# EAGLE schematic BRD_Board_G1_v53 (EAGLE 9.7.0)
COMPANY: ADAFRUIT INDUSTRIES; DRAWN: KTOWN; REV: B
Assembly variants: INDOOR, OUTDOOR
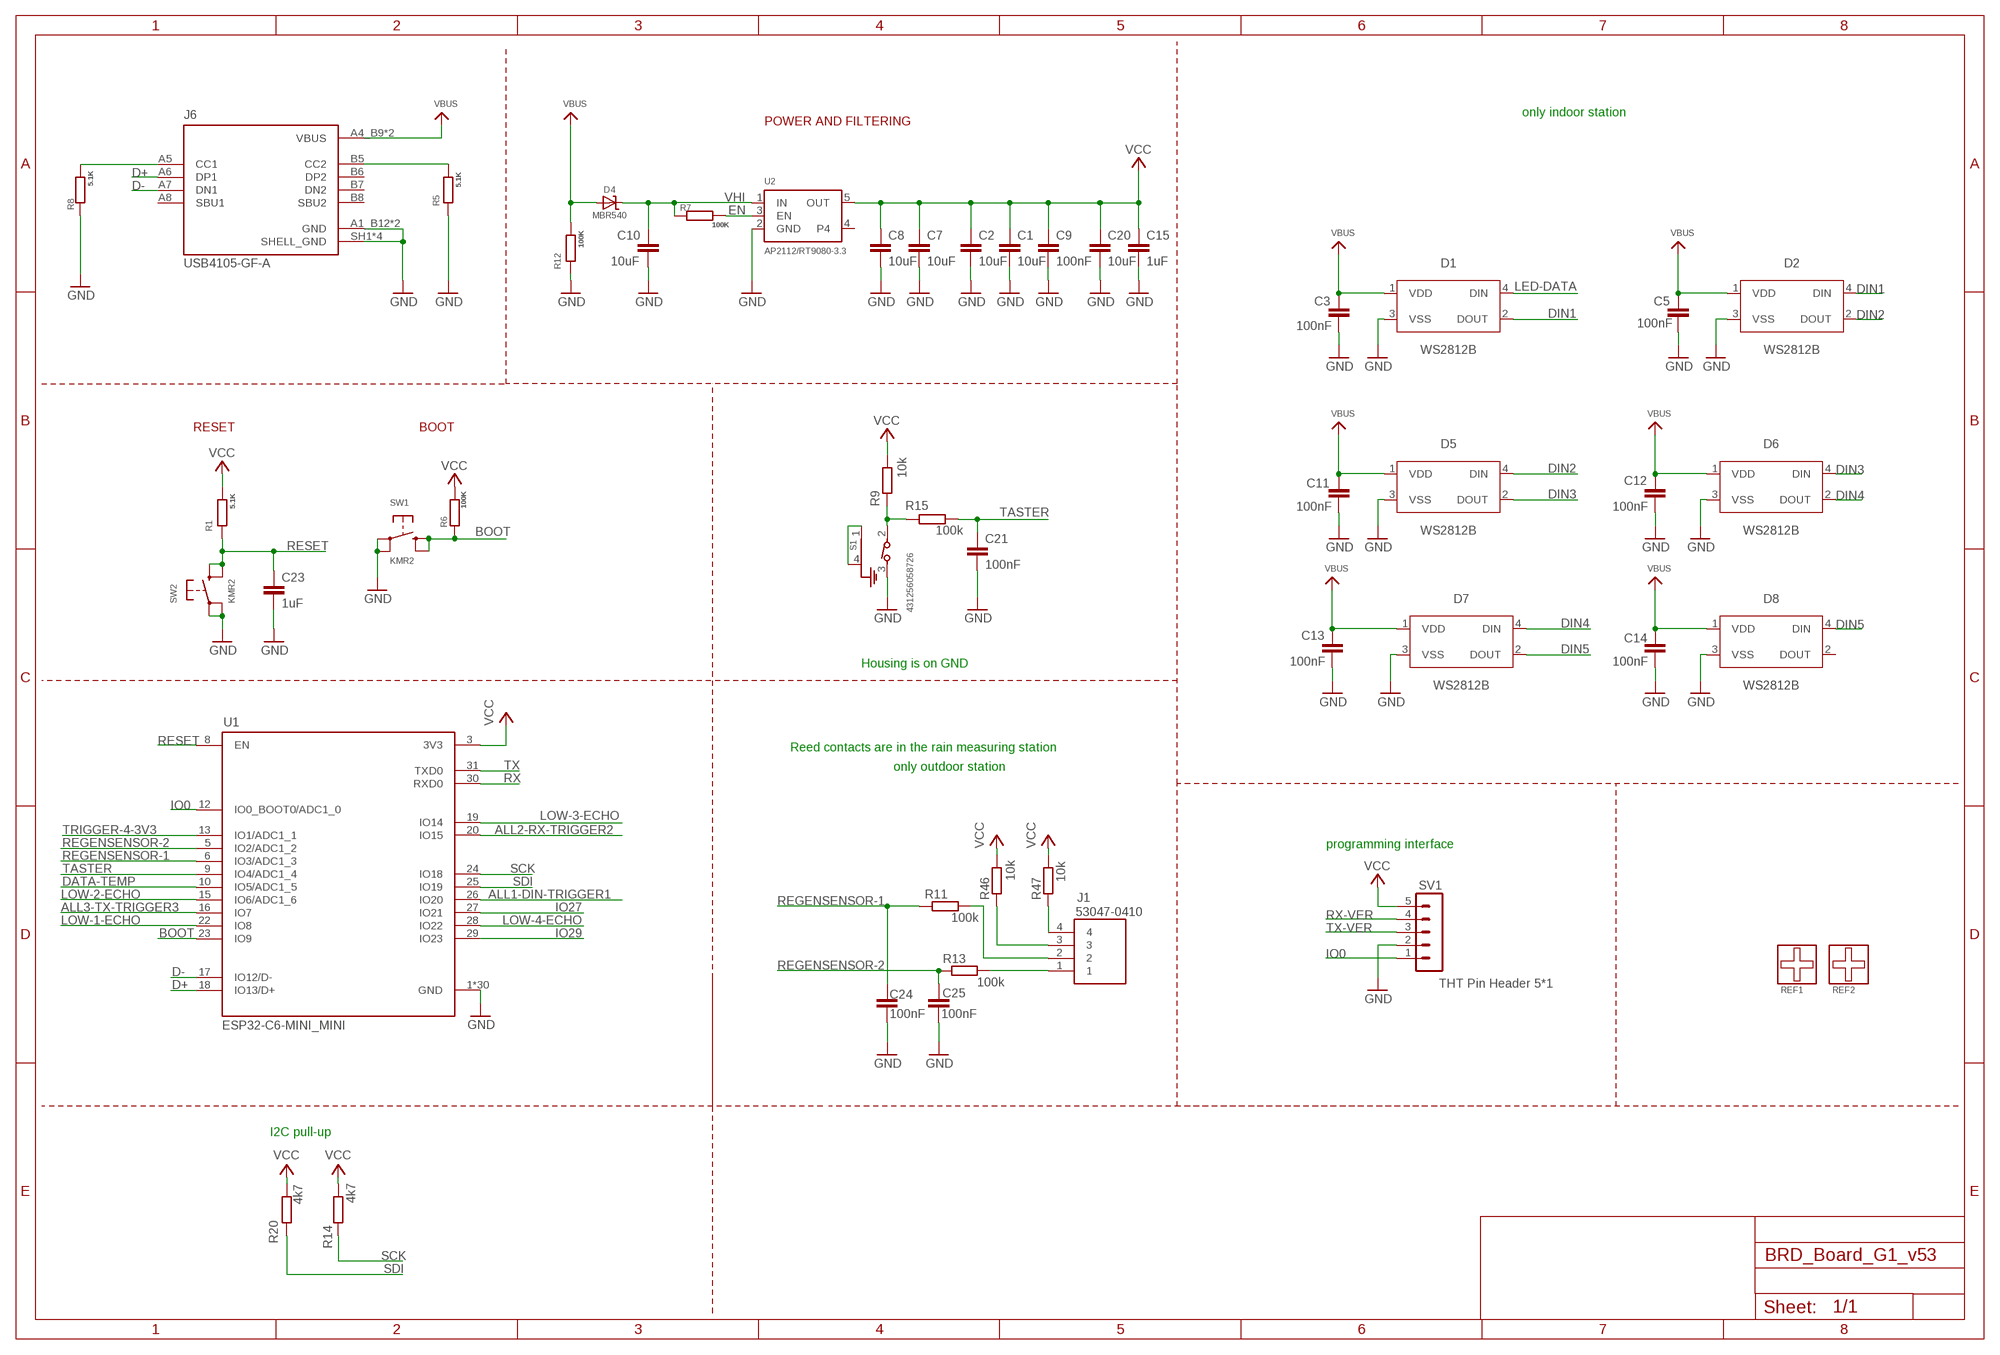
[diagram p0: schematic, sheet 1, part 1 of 2]
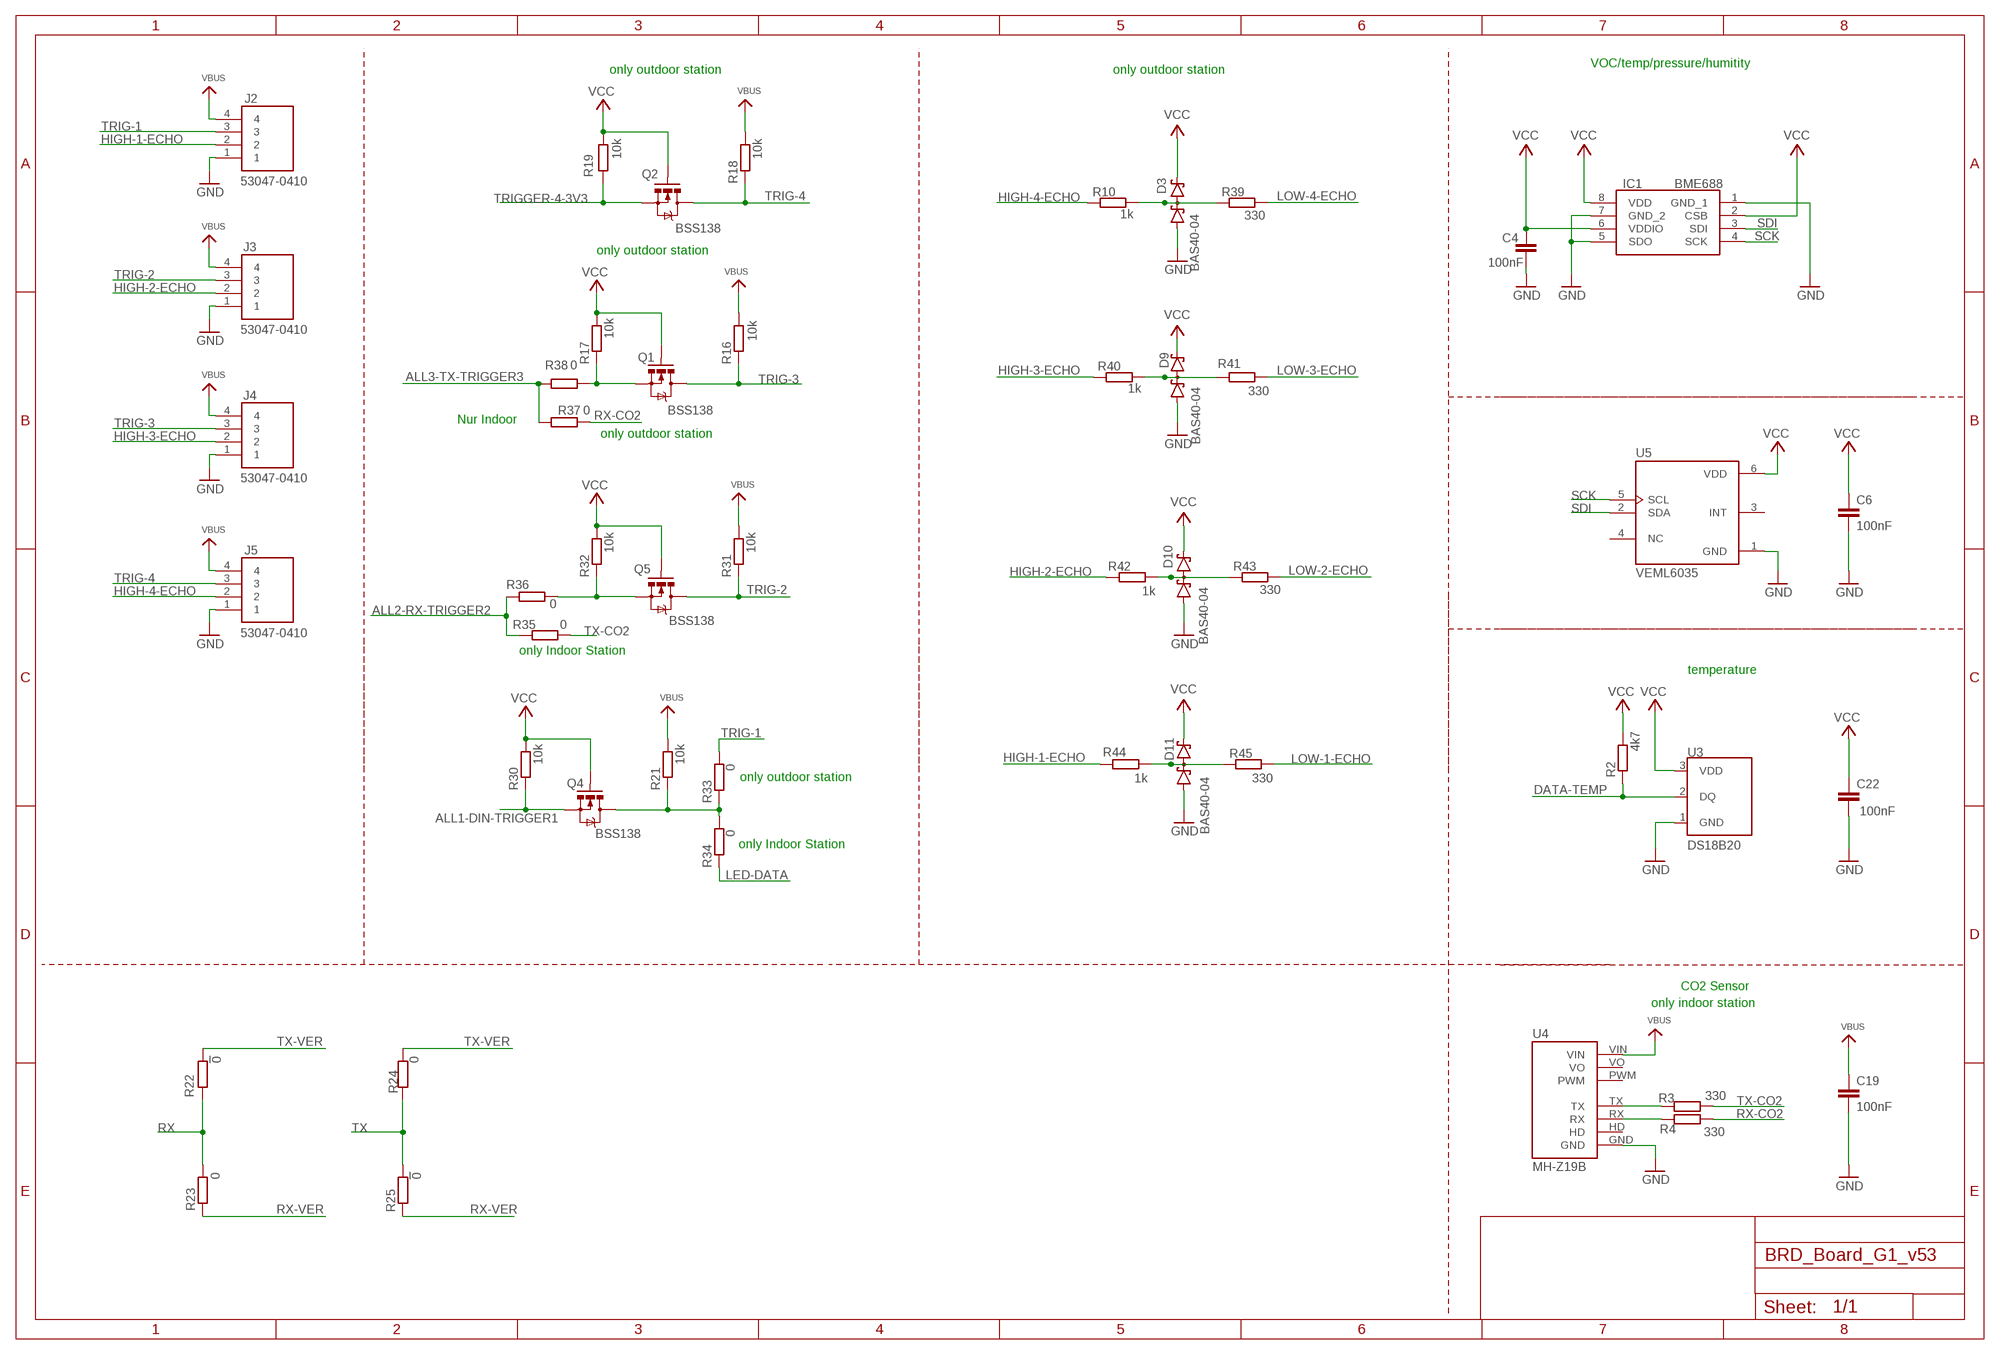
[diagram p1: schematic, sheet 1, part 2 of 2]

## Parts
C1  10uF  C-EUC0805K  [C0805K]
C2  10uF  C-EUC0805K  [C0805K]
C3  100nF  C-EUC0603K  [C0603K]  (not fitted in variant OUTDOOR)
C4  100nF  C-EUC0603K  [C0603K]
C5  100nF  C-EUC0603K  [C0603K]  (not fitted in variant OUTDOOR)
C6  100nF  C-EUC0603K  [C0603K]
C7  10uF  C-EUC0805K  [C0805K]
C8  10uF  C-EUC0805K  [C0805K]
C9  100nF  C-EUC0603K  [C0603K]
C10  10uF  C-EUC0805K  [C0805K]
C11  100nF  C-EUC0603K  [C0603K]  (not fitted in variant OUTDOOR)
C12  100nF  C-EUC0603K  [C0603K]  (not fitted in variant OUTDOOR)
C13  100nF  C-EUC0603K  [C0603K]  (not fitted in variant OUTDOOR)
C14  100nF  C-EUC0603K  [C0603K]  (not fitted in variant OUTDOOR)
C15  1uF  C-EUC0603K  [C0603K]
C19  100nF  C-EUC0603K  [C0603K]  (not fitted in variant OUTDOOR)
C20  10uF  C-EUC0805K  [C0805K]
C21  100nF  C-EUC0603K  [C0603K]
C22  100nF  C-EUC0603K  [C0603K]
C23  1uF  C-EUC0805K  [C0805K]
C24  100nF  C-EUC0603K  [C0603K]  (not fitted in variant INDOOR)
C25  100nF  C-EUC0603K  [C0603K]  (not fitted in variant INDOOR)
D1  WS2812B  [WS2812B]  (not fitted in variant OUTDOOR)
D2  WS2812B  [WS2812B]  (not fitted in variant OUTDOOR)
D3  BAS40-04  [SOT23]  (not fitted in variant INDOOR)
D4  MBR540  DIODE-SCHOTTKYSOD-123  [SOD-123]
D5  WS2812B  [WS2812B]  (not fitted in variant OUTDOOR)
D6  WS2812B  [WS2812B]  (not fitted in variant OUTDOOR)
D7  WS2812B  [WS2812B]  (not fitted in variant OUTDOOR)
D8  WS2812B  [WS2812B]  (not fitted in variant OUTDOOR)
D9  BAS40-04  [SOT23]  (not fitted in variant INDOOR)
D10  BAS40-04  [SOT23]  (not fitted in variant INDOOR)
D11  BAS40-04  [SOT23]  (not fitted in variant INDOOR)
IC1  BME688  [BME688]
J1  53047-0410  [530470410]  (not fitted in variant INDOOR)  (not fitted in variant OUTDOOR)
J2  53047-0410  [530470410]  (not fitted in variant INDOOR)  (not fitted in variant OUTDOOR)
J3  53047-0410  [530470410]  (not fitted in variant INDOOR)  (not fitted in variant OUTDOOR)
J4  53047-0410  [530470410]  (not fitted in variant INDOOR)  (not fitted in variant OUTDOOR)
J5  53047-0410  [530470410]  (not fitted in variant INDOOR)  (not fitted in variant OUTDOOR)
J6  USB4105-GF-A  [GCT_USB4105-GF-A]
Q1  BSS138  MOSFET-NCHANNELBSS138  [SOT23]  (not fitted in variant INDOOR)
Q2  BSS138  MOSFET-NCHANNELBSS138  [SOT23]  (not fitted in variant INDOOR)
Q4  BSS138  MOSFET-NCHANNELBSS138  [SOT23]
Q5  BSS138  MOSFET-NCHANNELBSS138  [SOT23]  (not fitted in variant INDOOR)
R1  5.1K  R-EU_R0805  [R0805]
R2  4k7  R-EU_R0805  [R0805]
R3  330  R-EU_R0805  [R0805]  (not fitted in variant OUTDOOR)
R4  330  R-EU_R0805  [R0805]  (not fitted in variant OUTDOOR)
R5  5.1K  R-EU_R0805  [R0805]
R6  100K  R-EU_R0805  [R0805]
R7  100K  R-EU_R0805  [R0805]
R8  5.1K  R-EU_R0805  [R0805]
R9  10k  R-EU_R0805  [R0805]
R10  1k  R-EU_R0805  [R0805]  (not fitted in variant INDOOR)
R11  100k  R-EU_R0805  [R0805]  (not fitted in variant INDOOR)
R12  100K  R-EU_R0805  [R0805]
R13  100k  R-EU_R0805  [R0805]  (not fitted in variant INDOOR)
R14  4k7  R-EU_R0805  [R0805]
R15  100k  R-EU_R0805  [R0805]
R16  10k  R-EU_R0805  [R0805]  (not fitted in variant INDOOR)
R17  10k  R-EU_R0805  [R0805]  (not fitted in variant INDOOR)
R18  10k  R-EU_R0805  [R0805]  (not fitted in variant INDOOR)
R19  10k  R-EU_R0805  [R0805]  (not fitted in variant INDOOR)
R20  4k7  R-EU_R0805  [R0805]
R21  10k  R-EU_R0805  [R0805]
R22  !0  R-EU_R0805  [R0805]  (not fitted in variant INDOOR)  (not fitted in variant OUTDOOR)
R23  0  R-EU_R0805  [R0805]
R24  0  R-EU_R0805  [R0805]
R25  !0  R-EU_R0805  [R0805]  (not fitted in variant INDOOR)  (not fitted in variant OUTDOOR)
R30  10k  R-EU_R0805  [R0805]
R31  10k  R-EU_R0805  [R0805]  (not fitted in variant INDOOR)
R32  10k  R-EU_R0805  [R0805]  (not fitted in variant INDOOR)
R33  0  R-EU_R0805  [R0805]  (not fitted in variant INDOOR)
R34  0  R-EU_R0805  [R0805]  (not fitted in variant OUTDOOR)
R35  0  R-EU_R0805  [R0805]  (not fitted in variant OUTDOOR)
R36  0  R-EU_R0805  [R0805]  (not fitted in variant INDOOR)
R37  0  R-EU_R0805  [R0805]  (not fitted in variant OUTDOOR)
R38  0  R-EU_R0805  [R0805]  (not fitted in variant INDOOR)
R39  330  R-EU_R0805  [R0805]  (not fitted in variant INDOOR)
R40  1k  R-EU_R0805  [R0805]  (not fitted in variant INDOOR)
R41  330  R-EU_R0805  [R0805]  (not fitted in variant INDOOR)
R42  1k  R-EU_R0805  [R0805]  (not fitted in variant INDOOR)
R43  330  R-EU_R0805  [R0805]  (not fitted in variant INDOOR)
R44  1k  R-EU_R0805  [R0805]  (not fitted in variant INDOOR)
R45  330  R-EU_R0805  [R0805]  (not fitted in variant INDOOR)
R46  10k  R-EU_R0805  [R0805]  (not fitted in variant INDOOR)
R47  10k  R-EU_R0805  [R0805]  (not fitted in variant INDOOR)
REF1  FIDUCIALFIDU_1_3_MM  [FIDU_1_3MM]  (not fitted in variant INDOOR)  (not fitted in variant OUTDOOR)
REF2  FIDUCIALFIDU_1_3_MM  [FIDU_1_3MM]  (not fitted in variant INDOOR)  (not fitted in variant OUTDOOR)
S1  431256058726  [4312560587X6]  (not fitted in variant INDOOR)  (not fitted in variant OUTDOOR)
SV1  THT Pin Header 5*1  MAR05-1  [MAR05-1]  (not fitted in variant INDOOR)  (not fitted in variant OUTDOOR)
SW1  KMR2  SWITCH_TACT_SMT_RKB2  [BTN_RKB2_4.6X2.8]
SW2  KMR2  SWITCH_TACT_SMT_RKB2  [BTN_RKB2_4.6X2.8]
U1  ESP32-C6-MINI_MINI  [ESP32-PICO-MINI]
U2  AP2112/RT9080-3.3  VREG_SOT23-5  [SOT23-5]
U3  DS18B20  [TO-92-AMMO]  (not fitted in variant INDOOR)  (not fitted in variant OUTDOOR)
U4  MH-Z19B  [MH-Z19B]  (not fitted in variant OUTDOOR)  (not fitted in variant INDOOR)
U5  VEML6035  [XDCR_VEML6035]

## Nets
ALL1-DIN-TRIGGER1: Q4.2(S) R30.1 U1.26(IO20)
ALL2-RX-TRIGGER2: R35.1 R36.1 U1.20(IO15)
ALL3-TX-TRIGGER3: R37.1 R38.1 U1.16(IO7)
BOOT: R6.1 SW1.B'(S1) SW1.B(S) U1.23(IO9)
D+: J6.A6(DP1) U1.18(IO13/D+)
D-: J6.A7(DN1) U1.17(IO12/D-)
DATA-TEMP: R2.1 U1.10(IO5/ADC1_5) U3.2(DQ)
DIN1: D1.2(DOUT) D2.4(DIN)
DIN2: D2.2(DOUT) D5.4(DIN)
DIN3: D5.2(DOUT) D6.4(DIN)
DIN4: D6.2(DOUT) D7.4(DIN)
DIN5: D7.2(DOUT) D8.4(DIN)
EN: R7.1 U2.3(EN)
GND: C1.2 C2.2 C3.2 C4.1 C5.2 C6.2 C7.2 C8.2 C9.2 C10.2 C11.2 C12.2 C13.2 C14.2 C15.2 C19.2 C20.2 C21.2 C22.1 C23.2 C24.2 C25.2 D1.3(VSS) D2.3(VSS) D3.1(A1) D5.3(VSS) D6.3(VSS) D7.3(VSS) D8.3(VSS) D9.1(A1) D10.1(A1) D11.1(A1) IC1.1(GND_1) IC1.5(SDO) IC1.7(GND_2) J2.1 J3.1 J4.1 J5.1 J6.A1_B12(GND) J6.B1_A12(GND) J6.SH1(SHELL_GND) J6.SH2(SHELL_GND) J6.SH3(SHELL_GND) J6.SH4(SHELL_GND) R5.1 R8.1 R12.1 S1.3 SV1.2 SW1.A'(P1) SW1.A(P) SW2.A'(P1) SW2.A(P) U1.1(GND) U1.2(GND) U1.11(GND) U1.14(GND) U1.36(GND) U1.37(GND) U1.38(GND) U1.39(GND) U1.40(GND) U1.41(GND) U1.42(GND) U1.43(GND) U1.44(GND) U1.45(GND) U1.46(GND) U1.47(GND) U1.48(GND) U1.49(GND) U1.50(GND) U1.51(GND) U1.52(GND) U1.53(GND) U1.54(GND) U1.55(GND) U1.56(GND) U1.57(GND) U1.58(GND) U1.59(GND) U1.60(GND) U1.61(GND) U2.2(GND) U3.1(GND) U4.GND U5.1(GND)
HIGH-1-ECHO: J2.2 R44.2
HIGH-2-ECHO: J3.2 R42.2
HIGH-3-ECHO: J4.2 R40.2
HIGH-4-ECHO: J5.2 R10.2
IO0: SV1.1 U1.12(IO0_BOOT0/ADC1_0)
IO27: U1.27(IO21)
IO29: U1.29(IO23)
LED-DATA: D1.4(DIN) R34.1
LOW-1-ECHO: R45.1 U1.22(IO8)
LOW-2-ECHO: R43.1 U1.15(IO6/ADC1_6)
LOW-3-ECHO: R41.1 U1.19(IO14)
LOW-4-ECHO: R39.1 U1.28(IO22)
N$1: R4.2 U4.RX
N$2: R9.1 R15.2 S1.2
N$3: R3.2 U4.TX
N$4: S1.1(GND1) S1.4(GND)
N$5: D3.3(C1A2) R10.1 R39.2
N$6: D9.3(C1A2) R40.1 R41.2
N$7: Q1.2(S) R17.1 R38.2
N$8: J6.A5(CC1) R8.2
N$9: J6.B5(CC2) R5.2
N$10: D10.3(C1A2) R42.1 R43.2
N$11: D11.3(C1A2) R44.1 R45.2
N$12: J1.3 R46.1
N$13: J1.4 R47.1
N$15: Q5.2(S) R32.1 R36.2
N$16: Q4.3(D) R21.1 R33.1 R34.2
N$17: J1.2 R11.1
N$19: J1.1 R13.1
REGENSENSOR-1: C24.1 R11.2 U1.6(IO3/ADC1_3)
REGENSENSOR-2: C25.1 R13.2 U1.5(IO2/ADC1_2)
RESET: C23.1 R1.1 SW2.B'(S1) SW2.B(S) U1.8(EN)
RX: R22.2 R23.1 U1.30(RXD0)
RX-CO2: R4.1 R37.2
RX-VER: R23.2 R25.2 SV1.4
SCK: IC1.4(SCK) R14.1 U1.24(IO18) U5.5(SCL)
SDI: IC1.3(SDI) R20.1 U1.25(IO19) U5.2(SDA)
TASTER: C21.1 R15.1 U1.9(IO4/ADC1_4)
TRIG-1: J2.3 R33.2
TRIG-2: J3.3 Q5.3(D) R31.1
TRIG-3: J4.3 Q1.3(D) R16.1
TRIG-4: J5.3 Q2.3(D) R18.1
TRIGGER-4-3V3: Q2.2(S) R19.1 U1.13(IO1/ADC1_1)
TX: R24.2 R25.1 U1.31(TXD0)
TX-CO2: R3.1 R35.2
TX-VER: R22.1 R24.1 SV1.3
VBUS: C3.1 C5.1 C11.1 C12.1 C13.1 C14.1 C19.1 D1.1(VDD) D2.1(VDD) D4.A D5.1(VDD) D6.1(VDD) D7.1(VDD) D8.1(VDD) J2.4 J3.4 J4.4 J5.4 J6.A4_B9(VBUS) J6.B4_A9(VBUS) R12.2 R16.2 R18.2 R21.2 R31.2 U4.VIN
VCC: C1.1 C2.1 C4.2 C6.1 C7.1 C8.1 C9.1 C15.1 C20.1 C22.2 D3.2(C2) D9.2(C2) D10.2(C2) D11.2(C2) IC1.2(CSB) IC1.6(VDDIO) IC1.8(VDD) Q1.1(G) Q2.1(G) Q4.1(G) Q5.1(G) R1.2 R2.2 R6.2 R9.2 R14.2 R17.2 R19.2 R20.2 R30.2 R32.2 R46.2 R47.2 SV1.5 U1.3(3V3) U2.5(OUT) U3.3(VDD) U5.6(VDD)
VHI: C10.1 D4.C R7.2 U2.1(IN)
Unconnected: D8.2(DOUT) J6.A8(SBU1) J6.B6(DP2) J6.B7(DN2) J6.B8(SBU2) REF1.P$1 REF2.P$1 U2.4 U4.HD U4.PWM U4.VO U5.3(INT) U5.4(NC)

## Notes on the sheet
- VOC/temp/pressure/humitity
- only outdoor station | only outdoor station
- only indoor station
- POWER AND FILTERING
- only outdoor station
- RESET | BOOT | Nur Indoor
- only outdoor station
- only Indoor Station
- Housing is on GND
- temperature
- Reed contacts are in the rain measuring station
- only outdoor station
- only outdoor station
- programming interface | only Indoor Station
- CO2 Sensor
- only indoor station
- I2C pull-up

## Library data of the parts
C1-C15 C19-C25 = rcl:C-EU: CAPACITOR, European symbol; SPICEPREFIX: C
D1 D2 D5-D8 = LED:WS2812B: Intelligent control LED integrated light source Datasheet <https://cdn-shop.adafruit.com/datasheets/WS2812B.pdf>; CATEGORY: LED; COLOR: RGB; DATASHEET: https://cdn-shop.adafruit.com/datasheets/WS2812B.pdf; DESCRIPTION: LED integrated light source; MANUFACTURER: Worldsemi; MPN: WS2812B; OPERATING_TEMPERATURE: -55°C ~ 150°C; PACKAGE_SIZE: 5050; PACKAGE_TYPE: SMD; PART_STATUS: ACTIVE; ROHS: COMPLIANT; SERIES: WS2812B; SUBCATEGORY: Chip LED Addressable; TYPE: Square with Flat Top
D3 D9-D11 = diode:BAS40-04: Silicon Schottky Diodes General-purpose diode for high-speed switching
D4 = microbuilder:DIODE-SCHOTTKY
IC1 = BME688:BME688: Gas sensor measuring relative humidity, barometric pressure, ambient temperature and gas (VOC) Source: Datasheet <https://www.bosch-sensortec.com/media/boschsensortec/downloads/datasheets/bst-bme688-ds000.pdf>; DESCRIPTION: Gas sensor measuring relative humidity, barometric pressure, ambient temperature and gas (VOC); HEIGHT: 1mm; MANUFACTURER_NAME: BOSCH; MANUFACTURER_PART_NUMBER: BME688; MOUSER_PART_NUMBER: 262-BME688; MOUSER_PRICE-STOCK: https://www.mouser.co.uk/ProductDetail/Bosch-Sensortec/BME688?qs=IS%252B4QmGtzzqQoVDscqwx3A%3D%3D
J1-J5 = 53047-0410:53047-0410: Headers & Wire Housings VERTICAL HDR 4P Source: Datasheet <https://www.molex.com/pdm_docs/sd/530470410_sd.pdf>; DESCRIPTION: Headers & Wire Housings VERTICAL HDR 4P; HEIGHT: 4.4mm; MANUFACTURER_NAME: Molex; MANUFACTURER_PART_NUMBER: 53047-0410; MOUSER_PART_NUMBER: 538-53047-0410; MOUSER_PRICE-STOCK: https://www.mouser.co.uk/ProductDetail/Molex/53047-0410?qs=DcEdecHHM4i8IPBxVAuJtg%3D%3D
J6 = USB4105-GF-A:USB4105-GF-A: Check availability <https://pricing.snapeda.com/parts/USB4105-GF-A/GCT/view-part?ref=eda>; AVAILABILITY: In Stock; CHECK_PRICES: https://www.snapeda.com/parts/USB4105-GF-A/Global+Connector+Technology/view-part/?ref=eda; DESCRIPTION: USB-C (USB TYPE-C) USB 2.0 Receptacle Connector 24 (16+8 Dummy) Position Surface Mount, Right Angle; Through Hole; MF: GCT; MP: USB4105-GF-A; PACKAGE: None; PRICE: None; SNAPEDA_LINK: https://www.snapeda.com/parts/USB4105-GF-A/Global+Connector+Technology/view-part/?ref=snap
Q1 Q2 Q4 Q5 = BeagleBone_Blue_R3:MOSFET-NCHANNEL: Common NMOSFET Parts MFG P/N Store ID Prod ID FDD8780 TRANS-09984 SI7820DN TRANS-11055 FDS6630A IC-08089 2N7002PW TRANS-11151 FQP30N06L COM-10213 TRANS-10060 BSS123LT1G TRANS-08345 BSS138 TRANS-00830 BS170 2N7000; PROD_ID: TRANS-00830
R1-R25 R30-R47 = rcl:R-EU_: RESISTOR, European symbol; SPICEPREFIX: R
REF1 REF2 = Fiducial_Infolog:FIDUCIAL
S1 = 431256058726:431256058726: Check availability <https://pricing.snapeda.com/parts/431256058716/W%C3%BCrth%20Elektronik/view-part?ref=eda>; AVAILABILITY: In Stock; CHECK_PRICES: https://www.snapeda.com/parts/431256058716/W%25C3%25BCrth+Elektronik+Midcom/view-part/?ref=eda; DESCRIPTION: Tactile Switch SPST-NO Side Actuated Through Hole, Right Angle; MF: Würth Elektronik; MP: 431256058716; PACKAGE: None; PRICE: None; SNAPEDA_LINK: https://www.snapeda.com/parts/431256058716/W%25C3%25BCrth+Elektronik+Midcom/view-part/?ref=snap
SV1 = con-lstb:MAR05-1: PIN HEADER; OC_FARNELL: unknown; OC_NEWARK: unknown
SW1 SW2 = adafruit_electromech:SWITCH_TACT_SMT: SMT Tact Switches RKB2 https://www.digikey.com/short/m027prz5
U1 = adafruit_wireless:ESP32-C6-MINI
U2 = adafruit_power:VREG_SOT23-5: SOT23-5 Fixed Voltage Regulators Part Current Out V Out V In V Dropout θJA (°C/W) TJ (°C) Digikey Part No. ADP121 150mA 3.3V 3.4-5.5V 0.09V @ 150mA -- -- ADP121-AUJZ33R7CT-ND ADP121 150mA 3.0V 3.1-5.5V 0.09V @ 150mA -- -- ADP121-AUJZ30R7CT-ND ADP122 300mA 3.3V 3.4-5.5V 0.085V @ 300mA -- -- ADP122AUJZ-3.3-R7CT-ND ADP1712 300mA 3.3V 3.5-5.5V 0.17V @ 300mA -- -- ADP1712AUJZ-3.3-R7TR-ND AP7311 (Low Cost) 150mA 3.3V 3.5-6V 0.15V @ 150mA -- -- AP7311-33WG-7DICT-ND LD39015M18R 150mA 1.8V 1.9V-5.5V 0.08V @ 100mA -- -- 497-6977-1-ND LP2985A-33DBVR 150mA 3.3V 3.3-16V 0.28V @ 150mA 206 150 296-18479-1-ND MCP1824T-3302E/OT 300mA 3.3V 3.5V-6V 0.2V @ 300mA -- -- MCP1824T-3302E/OTCT-ND MIC5205-2.5YM5 TR 150mA 2.5V 2.7-16V 0.165V @ 150mA -- -- 576-1257-2-ND MIC5205-3.0YM5 TR 150mA 3.0V 3.2V-16V 0.165V @ 150mA -- -- 576-1258-2-ND MIC5205-3.3YM5 TR 150mA 3.3V 3.5V-16V 0.165V @ 150mA -- -- 576-1259-2-ND TPS780330220 150mA 3.3V+2.2V 3.6-5.5V 250mV Max -- -- 296-23332-1-ND TDA3663/N1,135 100mA 3.3V 3.5-45V 0.18V @ 50mA -- -- 568-5343-1-ND Max operating temp can be calculated using θJA, TJ (max junction temperature), and power in watts. Set the "Maximum Ambient Temperature" until it reaches TJ ("Max Junction Temperature"), which is the absolute limit for safe use of the regulator: Heat Sink Temperature Calculator <http://www.daycounter.com/Calculators/Heat-Sink-Temperature-Calculator.phtml> For example, With 12V source into a 3.3V LP2985 and a 30mA load, we are dissipating (12V-3.3V) * 0.03A = 0.261W. With a θJA of 206 °C/W, a TJ of 150°C, and 261mW we can safely use the chip without a heat sink up to 75°C (=147.1°C Junction Temperature).; JLC_ROTATION: 0
U3 = SparkFun-Sensors:DS18B20: Dallas/Maxim DS18B20 1-Wire Temperature Sensor The DS18B20 reports degrees C with 9 to 12-bit precision, -55C to 125C (+/-0.5C). Each sensor has a unique 64-Bit Serial number etched into it - allows for a huge number of sensors to be used on one data bus. Datasheet <http://datasheets.maximintegrated.com/en/ds/DS18B20.pdf> SparkFun Products One Wire Digital Temperature Sensor - DS18B20 <https://www.sparkfun.com/products/245> (SEN-00245); STORE_ID: SEN-00245
U4 = MH-Z19B:MH-Z19B: Check availability <https://pricing.snapeda.com/parts/MH-Z19B/Winsen/view-part?ref=eda>; AVAILABILITY: Not in stock; CHECK_PRICES: https://www.snapeda.com/parts/MH-Z19B/Winsen/view-part/?ref=eda; DESCRIPTION: Intelligent Infrared CO2 Module; MF: Winsen; MP: MH-Z19B; PACKAGE: Package; PRICE: None; SNAPEDA_LINK: https://www.snapeda.com/parts/MH-Z19B/Winsen/view-part/?ref=snap
U5 = VEML6035:VEML6035: Check availability <https://pricing.snapeda.com/parts/VEML6035/Vishay%20Semiconductor%20Opto%20Division/view-part?ref=eda>; AVAILABILITY: In Stock; CHECK_PRICES: https://www.snapeda.com/parts/VEML6035/Vishay/view-part/?ref=eda; DESCRIPTION: Optical Sensor Ambient - I²C 6-SMD, No Lead; MF: Vishay Semiconductor Opto Division; MP: VEML6035; PACKAGE: SMD-6 Vishay Semiconductor Opto Division; PRICE: None; SNAPEDA_LINK: https://www.snapeda.com/parts/VEML6035/Vishay/view-part/?ref=snap

## Net classes
2 gnd: width 0.254 mm, drill 0.483 mm
3 Power: width 0.305 mm, drill 0.483 mm